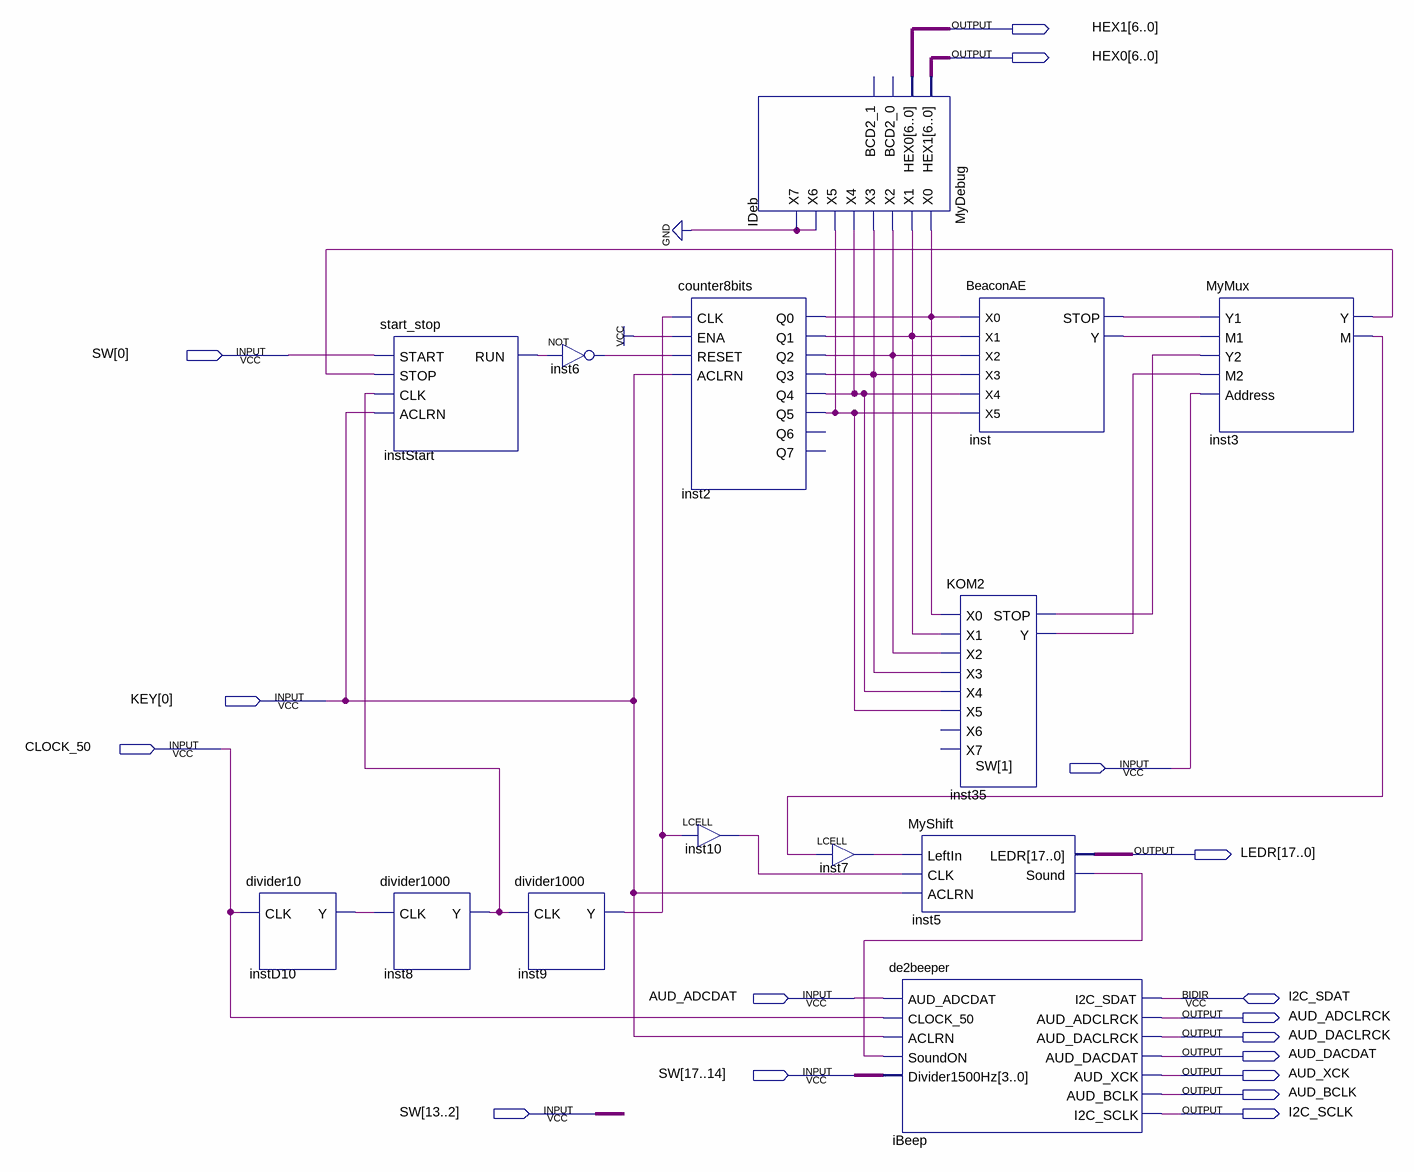
[diagram p0: schematic sheet]
// Quartus schematic Morse.bdf as structural Verilog: 14 symbols, 17 pins
module Morse (
  input  [17:0] SW,
  input  [0:0] KEY,
  input  CLOCK_50,
  input  AUD_ADCDAT,
  inout  I2C_SDAT,
  output [6:0] HEX1,
  output [6:0] HEX0,
  output [17:0] LEDR,
  output AUD_ADCLRCK,
  output AUD_DACLRCK,
  output AUD_DACDAT,
  output AUD_XCK,
  output AUD_BCLK,
  output I2C_SCLK
);

  wire inst2_q0, inst2_q1, inst2_q2, inst2_q3, inst2_q4, inst2_q5, inst3_m, inst3_y, inst5_sound, inst6_out,
       inst7_out, inst8_y, inst9_y, inst10_out, inst35_stop, inst35_y, inst_stop, inst_y, instD10_y,
       instStart_run;

  divider10 instD10 (.CLK(CLOCK_50), .Y(instD10_y));
  start_stop instStart (.START(SW[0]), .STOP(inst3_y), .CLK(inst8_y), .ACLRN(KEY[0]), .RUN(instStart_run));
  divider1000 inst8 (.CLK(instD10_y), .Y(inst8_y));
  not inst6 (inst6_out, instStart_run);
  divider1000 inst9 (.CLK(inst8_y), .Y(inst9_y));
  counter8bits inst2 (
    .CLK(inst9_y), .ENA(1'b1), .RESET(inst6_out), .ACLRN(KEY[0]), .Q0(inst2_q0), .Q1(inst2_q1),
    .Q2(inst2_q2), .Q3(inst2_q3), .Q4(inst2_q4), .Q5(inst2_q5));  // open: Q6, Q7
  LCELL inst10 (.IN(inst9_y), .OUT(inst10_out));
  MyDebug IDeb (
    .X0(inst2_q0), .X1(inst2_q1), .X2(inst2_q2), .X3(inst2_q3), .X4(inst2_q4), .X5(inst2_q5), .X6(1'b0),
    .X7(1'b0), .HEX1(HEX0), .HEX0(HEX1));  // open: BCD2_0, BCD2_1
  LCELL inst7 (.IN(inst3_m), .OUT(inst7_out));
  de2beeper iBeep (
    .AUD_ADCDAT(AUD_ADCDAT), .CLOCK_50(CLOCK_50), .ACLRN(KEY[0]), .SoundON(inst5_sound),
    .Divider1500Hz(SW[17:14]), .AUD_ADCLRCK(AUD_ADCLRCK), .AUD_DACLRCK(AUD_DACLRCK), .AUD_DACDAT(AUD_DACDAT),
    .AUD_XCK(AUD_XCK), .AUD_BCLK(AUD_BCLK), .I2C_SCLK(I2C_SCLK), .I2C_SDAT(I2C_SDAT));
  BeaconAE inst (
    .X0(inst2_q0), .X1(inst2_q1), .X2(inst2_q2), .X3(inst2_q3), .X4(inst2_q4), .X5(inst2_q5),
    .STOP(inst_stop), .Y(inst_y));
  KOM2 inst35 (
    .X0(inst2_q0), .X1(inst2_q1), .X2(inst2_q2), .X3(inst2_q3), .X4(inst2_q4), .X5(inst2_q5),
    .STOP(inst35_stop), .Y(inst35_y));  // open: X6, X7
  MyShift inst5 (.LeftIn(inst7_out), .CLK(inst10_out), .ACLRN(KEY[0]), .LEDR(LEDR), .Sound(inst5_sound));
  MyMux inst3 (.Y1(inst_stop), .M1(inst_y), .Y2(inst35_stop), .M2(inst35_y), .Address(SW[1]), .Y(inst3_y), .M(inst3_m));
endmodule
